# Altium schematic sheet power.SchDoc
size A4
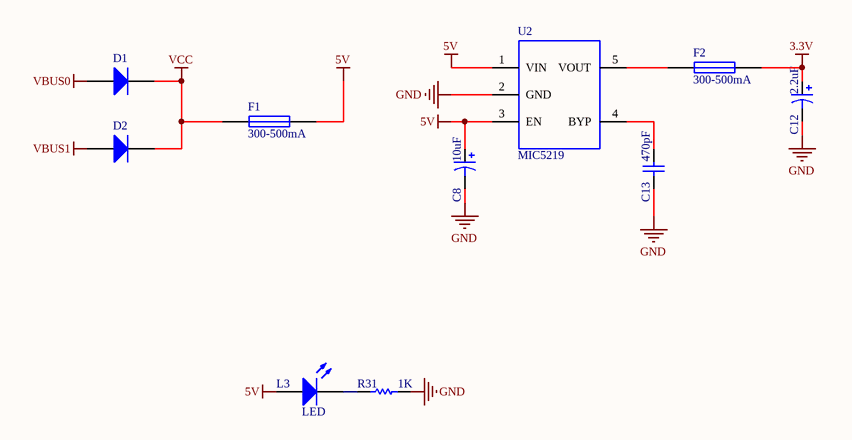
[diagram p0: power.SchDoc]

## Parts
C8  value 10uF  [1206(2)]  (hidden comment: Cap Pol1)
C12  value 2.2uF  [1206(2)]  (hidden comment: Cap Pol1)
C13  value 470pF  [1608[0603]]  (hidden comment: Cap)
D1  sk4  [1206(2)]  (value not drawn)
D2  sk4  [1206(2)]  (value not drawn)
F1  300-500mA  [1206(2)]
F2  300-500mA  [1206(2)]
L3  LED  [1608[0603]]
R31  value 1K  [1608[0603]]  (hidden comment: Res)
U2  MIC5219  [SOT-23-5]

## Nets
3.3V: C12.1 F2.2
5V: C8.1 F1.2 L3.1(A) U2.1(VIN) U2.3(EN)
GND: C8.2 C12.2 C13.1 R31.1 U2.2(GND)
VBUS0: D1.1(A)
VBUS1: D2.1(A)
VCC: D1.2(K) D2.2(K) F1.1
NetC13_2: C13.2 U2.4(BYP)
NetF2_1: F2.1 U2.5(VOUT)
NetL3_2: L3.2(K) R31.2

## Library data of the parts
C8 C12 = Cap Pol1: Polarized Capacitor (Radial); Published: 8-Jun-2000; LatestRevisionDate: 17-Jul-2002; LatestRevisionNote: Re-released for DXP Platform.; PackageReference: RB7.6-15; Publisher: Altium Limited; PackageDescription: Polarized Capacitor (Radial); 2 Leads
C13 = Cap: 贴片电容; Published: 8-Jun-2000; LatestRevisionDate: 17-Jul-2002; LatestRevisionNote: Re-released for DXP Platform.; PackageReference: RAD-0.3; Publisher: Altium Limited
D1 D2 = Diode 1N4001: 1 Amp General Purpose Rectifier; Published: 8-Jun-2000; LatestRevisionDate: 17-Jul-2002; LatestRevisionNote: Re-released for DXP Platform.; DatasheetVersion: 1998; PackageVersion: Aug-1999; PackageReference: DO-41; Publisher: Altium Limited; PackageDescription: Diode, Axial; Body 5.2 x 2.7 mm (LxDia. max), Lead Dia. 0.86 mm (max); Code_JEDEC: DO-204-AL; ComponentLink1Description: Manufacturer Link; ComponentLink1URL: http://www.fairchildsemi.com/; ComponentLink2Description: Datasheet; ComponentLink2URL: http://www.fairchildsemi.com/ds/1N%2F1N4001.pdf
F1 F2 = Fuse 1: Fuse; Published: 8-Jun-2000; LatestRevisionDate: 17-Jul-2002; LatestRevisionNote: Re-released for DXP Platform.; PackageReference: PIN-W2/E2.8; Publisher: Altium Limited
R31 = Res: 贴片电阻; Published: 8-Jun-2000; LatestRevisionDate: 17-Jul-2002; LatestRevisionNote: Re-released for DXP Platform.; PackageReference: AXIAL-0.3; Publisher: Altium Limited
U2 = MIC5219: LDO